# Altium project Dog Tag.PrjPcb
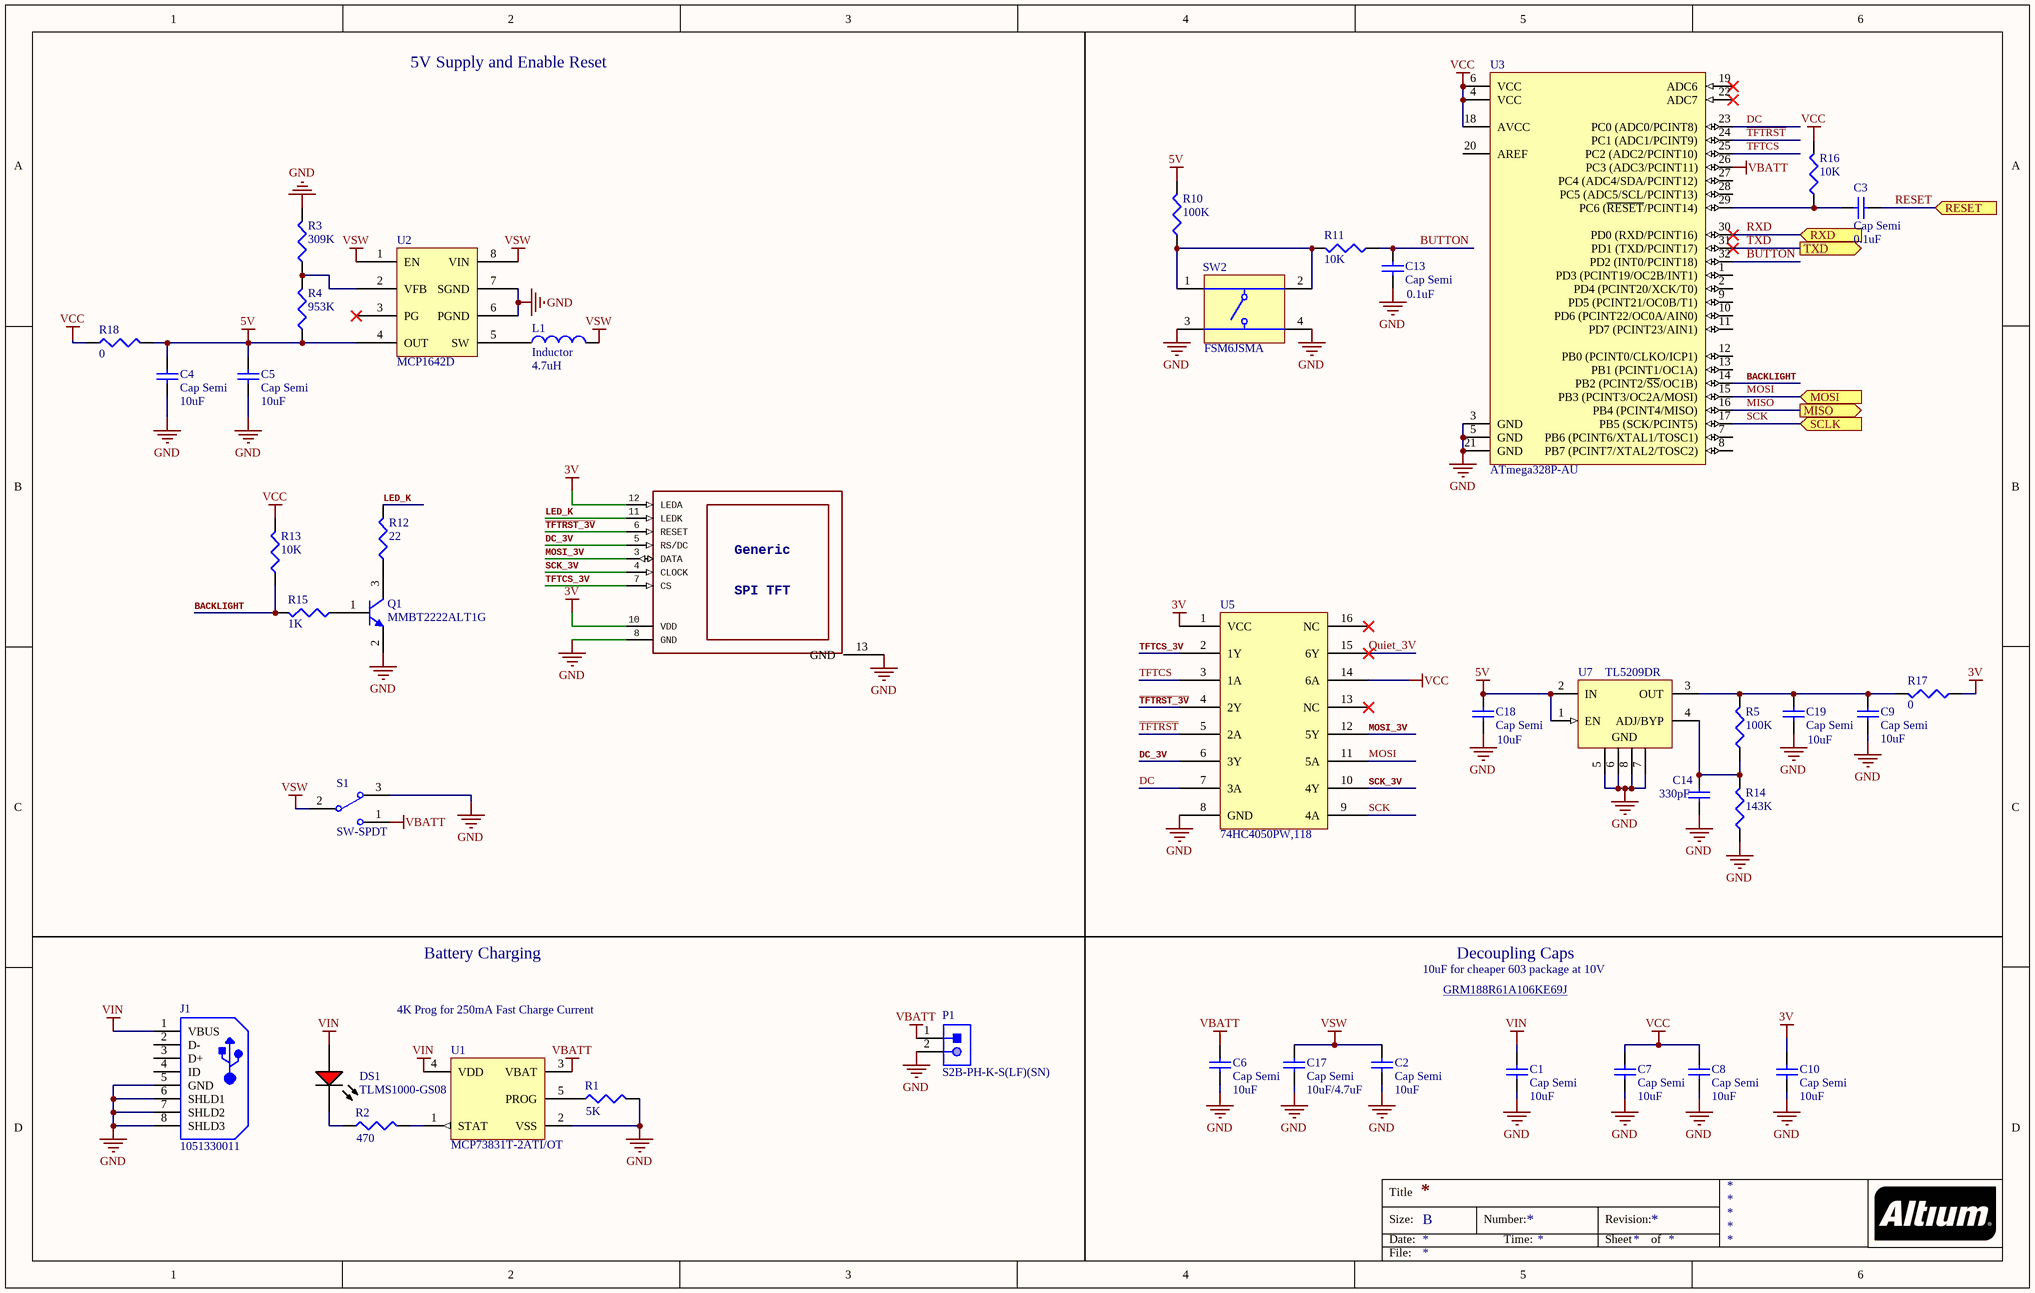
[diagram p0: Dog_Tag.SchDoc]
1 sheet, 42 parts. Net scope: flat (ports and power ports of the same name join across sheets).
Board file: Dog_Tag.PcbDoc

## Sheet Dog_Tag.SchDoc
size B

### Parts
C1  Cap Semi  value 10uF  [1608[0603]]
C2  Cap Semi  value 10uF  [1608[0603]]
C3  Cap Semi  value 0.1uF  [1608[0603]]
C4  Cap Semi  value 10uF  [1608[0603]]
C5  Cap Semi  value 10uF  [1608[0603]]
C6  Cap Semi  value 10uF  [1608[0603]]
C7  Cap Semi  value 10uF  [1608[0603]]
C8  Cap Semi  value 10uF  [1608[0603]]
C9  Cap Semi  value 10uF  [1608[0603]]
C10  Cap Semi  value 10uF  [1608[0603]]
C13  Cap Semi  value 0.1uF  [1608[0603]]
C14  value 330pF  [1608[0603]]  (hidden comment: Cap Semi)
C17  Cap Semi  value 10uF/4.7uF  [1608[0603]]
C18  Cap Semi  value 10uF  [1608[0603]]
C19  Cap Semi  value 10uF  [1608[0603]]
DISP1  SPITFT: SPI TFT  [TFT1.14]  (hidden comment: DISP_LCD_GENERIC_SPI_1.14IN_240X135_WRAPUNDER)
DS1  TLMS1000-GS08  [VISH-TLMS1000_V]
J1  1051330011  [MOLX-1051330011-5_V]
L1  Inductor  value 4.7uH  [SRN4018TA-4R7M]
P1  S2B-PH-K-S(LF)(SN)  [JST-S2B-PH-K-S_V]
Q1  MMBT2222ALT1G  [ONSC-SOT-23-3-318-08_V]
R1  value 5K  [J1-0603]  (hidden comment: Res3)
R2  value 470  [J1-0603]  (hidden comment: Res3)
R3  value 309K  [J1-0603]  (hidden comment: Res3)
R4  value 953K  [J1-0603]  (hidden comment: Res3)
R5  value 100K  [J1-0603]  (hidden comment: Res3)
R10  value 100K  [J1-0603]  (hidden comment: Res3)
R11  value 10K  [J1-0603]  (hidden comment: Res3)
R12  value 22  [J1-0603]  (hidden comment: Res3)
R13  value 10K  [J1-0603]  (hidden comment: Res3)
R14  value 143K  [J1-0603]  (hidden comment: Res3)
R15  value 1K  [J1-0603]  (hidden comment: Res3)
R16  value 10K  [J1-0603]  (hidden comment: Res3)
R17  value 0  [J1-0603]  (hidden comment: Res3)
R18  value 0  [J1-0603]  (hidden comment: Res3)
S1  SW-SPDT  [OS102011MA1QN1]
SW2  FSM6JSMA  [TECO-FSM6JSMA_V]
U1  MCP73831T-2ATI/OT  [SOT-23-OT5_M]
U2  MCP1642D  [MCP1642D]
U3  ATmega328P-AU  [32A_L]
U5  74HC4050PW,118  [74HC4050PW]
U7  TL5209DR  [D0008A_N]

### Ports
MISO (out), MOSI (in), RESET (in), RXD (in), SCLK (in), TXD (out)

### Nets
3V: C10.2 DISP1.10(VDD) DISP1.12(LEDA) R17.1 U5.1(VCC)
5V: C4.2 C5.2 C18.2 R4.1 R10.2 R18.2 U2.4(OUT) U7.1(EN) U7.2(IN)
GND: C1.1 C2.1 C4.1 C5.1 C6.1 C7.1 C8.1 C9.1 C10.1 C13.1 C14.1 C17.1 C18.1 C19.1 DISP1.8(GND) DISP1.13(GND) J1.5(GND) J1.6(SHLD1) J1.7(SHLD2) J1.8(SHLD3) P1.2 Q1.2(E) R1.2 R3.2 R14.1 S1.3 SW2.3 SW2.4 U1.2(VSS) U2.6(PGND) U2.7(SGND) U3.3(GND) U3.5(GND) U3.21(GND) U5.8(GND) U7.5(GND) U7.6(GND) U7.7(GND) U7.8(GND)
VBATT: C6.2 P1.1 S1.1 U1.3(VBAT) U3.26(PC3_(ADC3/PCINT11))
VCC: C7.2 C8.2 R13.2 R16.2 R18.1 U3.4(VCC) U3.6(VCC) U3.18(AVCC) U5.14(6A)
VIN: C1.2 DS1.1(A) J1.1(VBUS) U1.4(VDD)
VSW: C2.2 C17.2 L1.2 S1.2 U2.1(EN) U2.8(VIN)
BACKLIGHT: R13.1 R15.2 U3.14(PB2_(PCINT2/~{SS}/OC1B))
BUTTON: C13.2 R11.1 U3.32(PD2_(INT0/PCINT18))
DC: U3.23(PC0_(ADC0/PCINT8)) U5.7(3A)
DC_3V: DISP1.5(RS/DC) U5.6(3Y)
LED_K: DISP1.11(LEDK) R12.2
MISO: U3.16(PB4_(PCINT4/MISO)) ; port MISO
MOSI: U3.15(PB3_(PCINT3/OC2A/MOSI)) U5.11(5A) ; port MOSI
MOSI_3V: DISP1.3(DATA) U5.12(5Y)
Quiet_3V: U5.15(6Y)
RESET: C3.1 ; port RESET
RXD: U3.30(PD0_(RXD/PCINT16)) ; port RXD
SCK: U3.17(PB5_(SCK/PCINT5)) U5.9(4A) ; port SCLK
SCK_3V: DISP1.4(CLOCK) U5.10(4Y)
~{TFTRST}: U3.24(PC1_(ADC1/PCINT9)) U5.5(2A)
~{TFTRST_3V}: DISP1.6(RESET) U5.4(2Y)
TFTCS: U3.25(PC2_(ADC2/PCINT10)) U5.3(1A)
TFTCS_3V: DISP1.7(CS) U5.2(1Y)
TXD: U3.31(PD1_(TXD/PCINT17)) ; port TXD
NetC3_2: C3.2 R16.1 U3.29(PC6_(~{RESET}/PCINT14))
NetC9_2: C9.2 C19.2 R5.2 R17.2 U7.3(OUT)
NetC14_2: C14.2 R5.1 R14.2 U7.4(ADJ/BYP)
NetDS1_2: DS1.2(K) R2.1
NetL1_1: L1.1 U2.5(SW)
NetQ1_1: Q1.1(B) R15.1
NetQ1_3: Q1.3(C) R12.1
NetR1_1: R1.1 U1.5(PROG)
NetR2_2: R2.2 U1.1(STAT)
NetR3_1: R3.1 R4.2 U2.2(VFB)
NetR10_1: R10.1 R11.2 SW2.1 SW2.2

Not connected (* = marked no-connect by the designer): J1 2(D-) 3(D+) 4(ID); U2 3(PG)*; U3 1(PD3_(PCINT19/OC2B/INT1)) 2(PD4_(PCINT20/XCK/T0)) 7(PB6_(PCINT6/XTAL1/TOSC1)) 8(PB7_(PCINT7/XTAL2/TOSC2)) 9(PD5_(PCINT21/OC0B/T1)) 10(PD6_(PCINT22/OC0A/AIN0)) 11(PD7_(PCINT23/AIN1)) 12(PB0_(PCINT0/CLKO/ICP1)) 13(PB1_(PCINT1/OC1A)) 19(ADC6)* 20(AREF) 22(ADC7)* 27(PC4_(ADC4/SDA/PCINT12)) 28(PC5_(ADC5/SCL/PCINT13)); U5 13(NC)* 16(NC)*

### Notes on the sheet
- 5V Supply and Enable Reset
- Battery Charging
- 10uF for cheaper 603 package at 10V
- Decoupling Caps
- 4K Prog for 250mA Fast Charge Current
- GRM188R61A106KE69J <https://www.digikey.com/product-detail/en/murata-electronics/GRM188R61A106KE69J/490-14372-1-ND/6606833>
- Title
- Size:
- Date:
- B
- Number:
- Time:
- Revision:
- Sheet
- of
- File:

### Library data of the parts
C1-C10 C13 C14 C17-C19 = Cap Semi: Capacitor (Semiconductor SIM Model); Published: 8-Jun-2000; LatestRevisionDate: 29-May-2009; LatestRevisionNote: IPC-7351 Footprint Added.; PackageReference: C1206; Publisher: Altium Limited; PackageDescription: Chip Capacitor
DISP1 = DISP_LCD_GENERIC_SPI_1.14IN_240X135_WRAPUNDER: GateName_1: G$1; SymbolName_1: TFT_GENERIC_SPI_VDD; DeviceName: _1.14IN_240X135_WRAPUNDER; LibraryName: microbuilder; DeviceSetName: DISP_LCD_GENERIC_SPI; Generic: Generic
DS1 = CMP-2000-07254-1: Low Current LED, 40 mW, 1.8 V, -40 to 100 degC, 2-Pin SMD (0603), RoHS, Tape and Reel; Manufacturer: Vishay; Lens Shape: Rectangular; Automotive Qualification Standard: AEC-Q100; Wavelength Typ: 636nm; SVHC: ToBeAdvised; LED Colour: Red; Bulb Size: 1.6mmx0.8mm; Forward Voltage: 1.8V; Luminous Intensity: 4mcd; Forward Current If: 2mA; Viewing Angle: 80°; Datasheet Version: Rev. 1.7, 02/2011; Datasheet URL: https://datasheet.ciiva.com/5798/1698881-5798337.pdf; LED Mounting: SMD; Packaging: CutTape; Package Reference: TLMS1000; Manufacturer URL: http://www.vishay.com/; Mounting Technology: SurfaceMount; Product Range: -; Package Description: 2-Pin Surface Mount Device, Body 1.6 x 0.8 mm; MSL: MSL2-1year
J1 = CMP-2000-05241-1: Micro-B USB Vertical Type, -30 to 85 degC, 5-Pin SMD, RoHS, Tape and Reel; Manufacturer: Molex; PCN Other: 105133Series21/Jul/2015; Online Catalog: Molex-MicroUSB; Connector Type: USB-microB; 3D Model: 105133-0011.stp; Other Names: 105133-0011887191097947WM10134TR; Gender: Receptacle; PCN Packaging: 105133Series03/Oct/2015; Featured Product: USBConnectors; Number of Contacts: 5; Mounting Type: SurfaceMountVertical; Manufacturer URL: http://www.molex.com/; Features: BoardGuide; Standard Package: 500; Family: USB,DVI,HDMIConnectors; Ingress Protection: -; Datasheet Version: Rev. G, 01/2011; Packaging: Tape&Reel(TR); Specifications: -; RoHS Information: 105133-0011Cert.ofCompliance; Series: 105133; Datasheet URL: http://www.molex.com/pdm_docs/sd/1051330011_sd.pdf; Category: Connectors,Interconnects
L1 = Inductor: Code_IEC: 1005; Published: 8-Jun-2000; LatestRevisionDate: 29-May-2009; LatestRevisionNote: IPC-7351 Footprint Added.; PackageReference: 0402-A; Publisher: Altium Limited; PackageDescription: Chip Inductor; Code_JEITA: 0402; ComponentLink1Description: Digikey; ComponentLink1URL: https://www.digikey.com/product-detail/en/taiyo-yuden/NRS5020T100MMGJ/587-2409-1-ND/2230275; ComponentLink2Description: 4.7uH Digikey; ComponentLink2URL: https://www.digikey.com/product-detail/en/bourns-inc/SRN4018TA-4R7M/SRN4018TA-4R7MCT-ND/6565084
P1 = CMP-1755-00004-1: Male Header, Pitch 2 mm, 1 x 2 Position, Height 4.8 mm, Tail Length 3.4 mm, -25 to 85 degC, RoHS, Bulk; Case\Package: Radial; Tolerance: 20%; Capacitance: 10 uF; Voltage Rating (DC): 50 V; Packaging: Bulk; ComponentLink1URL: http://www.jst-mfg.com/product/pdf/eng/ePH.pdf; Radiation Hardening: No; Height: 11 mm; Package Quantity: 200; PackageDescription: Male Header, Pitch 2 mm, 1 x 2 Position, Height 4.8 mm, Tail Length 3.4 mm; PackageReference: S2B-PH-K-S; Diameter: 5 mm; Pins: 2; Mount: Through Hole; Max Operating Temperature: 85 degC; Min Operating Temperature: -40 degC; ComponentLink1Description: Datasheet; DatasheetVersion: Dec-12; Length: 11 mm; Lead Pitch: 2 mm; REACH SVHC: No SVHC; Voltage Rating: 50 V; RoHSCompliant: true
Q1 = CMP-1048-00538-1: General Purpose Transistor, NPN Silicon, 3-Pin SOT-23, Pb-Free, Tape and Reel; Manufacturer: On Semiconductor; fT Min (MHz): 300; IC Continuous (A): 0.6; ComponentLink3URL: http://www.onsemi.cn/pub_link/Collateral/318-08.PDF; PartNumber: MMBT2222ALT1G; RoHS: TRUE; ComponentLink1URL: http://www.onsemi.com/; ComponentLink3Description: Package Specification; ComponentLink2Description: Datasheet; Mounting Technology: Surface Mount; Packing: Tape and Reel; PackageDescription: 3-Pin Small Outline Transistor, Body 2.92 x 1.3 mm, Pitch 0.95 mm; DatasheetVersion: Rev. 10; PackageReference: SOT-23-3-318-08; ComponentLink2URL: http://www.onsemi.cn/pub_link/Collateral/MMBT2222LT1-D.PDF; Polarity: NPN; PackageVersion: Rev. AP, 11/2009; ComponentLink1Description: Manufacturer URL
R1-R5 R10-R18 = Res3: Resistor; Published: 8-Jun-2000; LatestRevisionDate: 29-May-2009; LatestRevisionNote: IPC-7351 Footprint Added.; PackageReference: J1-0603; Publisher: Altium Limited; PackageDescription: Chip Resistor
S1 = SW-SPDT: SPDT Subminiature Toggle Switch, Right Angle Mounting, Vertical Actuation; Published: 24-Mar-1999; LatestRevisionDate: 17-Dec-2003; LatestRevisionNote: Schematic revised, PCB Footprint replaced.; DatasheetVersion: 05-Dec-2000; PackageReference: TL36WW15050; Publisher: Altium Limited; PackageDescription: Switch; 4 Leads; ComponentLink1Description: Manufacturer Link; ComponentLink1URL: http://www.apem.com
SW2 = CMP-2000-07503-1: Switch, SPST, 24 V, -35 to 85 degC, 4-Pin SMD, RoHS, Tape and Reel; Manufacturer: TE Connectivity; Electrical Life: 100000Cycles; Voltage Rating (DC): 24V; Contact Resistance: 100mOhm; Case\/Package: SMD/SMT; Actuator Length: 3.4mm; Contact Current Rating: 50mA; Operating Force: 1.57N; Max Voltage Rating (DC): 12V; Illumination Type: Illuminated; Actuator Material: Polyamide; Switch Travel: 0.25mm; Contact Plating: Silver; Mount: SurfaceMount; Contact Material: CopperAlloy; RoHSCompliant: true; Width: 6mm; Package Reference: FSM6JSMA; Manufacturer URL: http://www.te.com/; Min Operating Temperature: -35degC; REACH SVHC: Unknown; Datasheet Version: Rev. V, 02/2015; Package Quantity: 750; Voltage Rating: 24V; Termination: GullWing; Mechanical Life: 100000Cycles; Mounting Technology: SurfaceMount; Insulation Resistance: 100MOhm; Packaging: LoosePiece; Package Description: 4-Pin Surface Mount Device, Body 6 x 6 mm, Pitch 4.5 mm; Orientation: Straight; Max Operating Temperature: 85degC; Length: 6mm; Current Rating: 50mA; Datasheet URL: http://www.te.com/commerce/DocumentDelivery/DDEController?Action=showdoc&DocId=Customer+Drawing%7F2-1437565-7%7FV%7Fpdf%7FEnglish%7FENG_CD_2-1437565-7_V.pdf%7F4-1437565-9; Lead Free: LeadFree; ELV: Compliant; Throw Configuration: SPST
U1 = CMP-0133-00144-1: Miniature Single-Cell, Fully Integrated Li-Ion, Li-Polymer Charge Management Controller, 4.2V, 5-Pin SOT-23, Industrial Temperature, Tape and Reel; DatasheetVersion: revE, Sep-2008; PackageVersion: revBB, Aug-2009; PackageReference: SOT-23-OT5; PackageDescription: 5-Lead Plastic Small Outline Transistor (OT) [SOT-23]; Code_IPC: SOT23-5
U2 = MCP1642D-ADJI/MS: Boost Switching Regulator IC Positive Adjustable 1.8V 1 Output 800mA 8-TSSOP, 8-MSOP (0.118", 3.00mm Width); ComponentLink1Description: Digikey; ComponentLink1URL: https://www.digikey.com/product-detail/en/microchip-technology/MCP1642D-ADJI-MS/MCP1642D-ADJI-MS-ND/5137721
U3 = CMP-0095-00269-2: 8-bit AVR Microcontroller, 32KB Flash, 1KB EEPROM, 2KB SRAM, 32-pin TQFP, Industrial Grade (-40°C to 85°C); PackageDescription: 32-Lead, 7x7x1.0 mm Body, 0.8mm Lead Pitch, Thin Profile Plastic Quad Flat Package (TQFP); DatasheetVersion: revD, May-2011; RevisionNote: DatasheetVersion & PackageVersion updated. URLs added.; ComponentLink1URL: http://www.atmel.com/; ComponentLink2Description: ATmega48A/48PA/88A/88PA/168A/168PA/328/328P Datasheet; Code_JEDEC: MS-026-ABA; ComponentLink1Description: Manufacturer URL; PackageReference: 32A; ComponentLink3Description: ATmega48A/48PA/88A/88PA/168A/168PA/328/328P Summary; ComponentLink2URL: http://www.atmel.com/dyn/resources/prod_documents/doc8271.pdf; PackageVersion: revC, Oct-2010; ComponentLink3URL: http://www.atmel.com/dyn/resources/prod_documents/8271S.pdf
U5 = 74HC4050PW,118: Buffer/LevelShifter, Non-Inverting 6 Element 1 Bit per Element Push-Pull Output 16-TSSOP; ComponentLink1Description: Digikey; ComponentLink1URL: https://www.digikey.com/product-detail/en/nexperia-usa-inc/74HC4050PW118/1727-5956-1-ND/2753784
U7 = CMP-0395-00183-2: Single Output Low Noise LDO, 500 mA, Adjustable 1.3 to 6.5 V Output, 2.5 to 16 V Input, 8-pin SOIC (D), -40 to 125 degC, Green (RoHS & no Sb/Br); Manufacturer: Texas Instruments; Rating: Catalog; SubFamily: Single Channel LDO; Vout Adj(Max)(V): 6.5; Vout Adj(Min)(V): 2.5; Vin(Max)(V): 16; Iout(Max)(A): 0.5; Iq(Typ)(mA): 8; Accuracy(%): 2; Vdo(Typ)(mV): 500; ComponentLink2Description: Datasheet; ComponentLink1URL: http://www.ti.com/; Mounting Technology: Surface Mount; PackageDescription: 8-Pin Plastic Small Outline, Body 4.9 x 3.9 mm, Pitch 1.27 mm; Code_JEDEC: MS-012; ComponentLink4URL: Samples URL:http://www.ti.com/product/tl5209#samples; PackageVersion: 4040047-3/M; PartNumber: TL5209DR; DatasheetVersion: SLVS581A; PackageReference: D0008A; ComponentLink3URL: http://www.ti.com/litv/pdf/msoi002j; Vin(Min)(V): 2.5; ComponentLink1Description: Manufacturer URL; Eco-Plan: Green (RoHS & no Sb/Br); ComponentLink2URL: http://www.ti.com/general/docs/lit/getliterature.tsp?genericPartNumber=TL5209&fileType=pdf; ComponentLink4Description: URL Link1; ComponentLink3Description: Package Specification